# EAGLE design KK V5.5 (EAGLE 5.08)
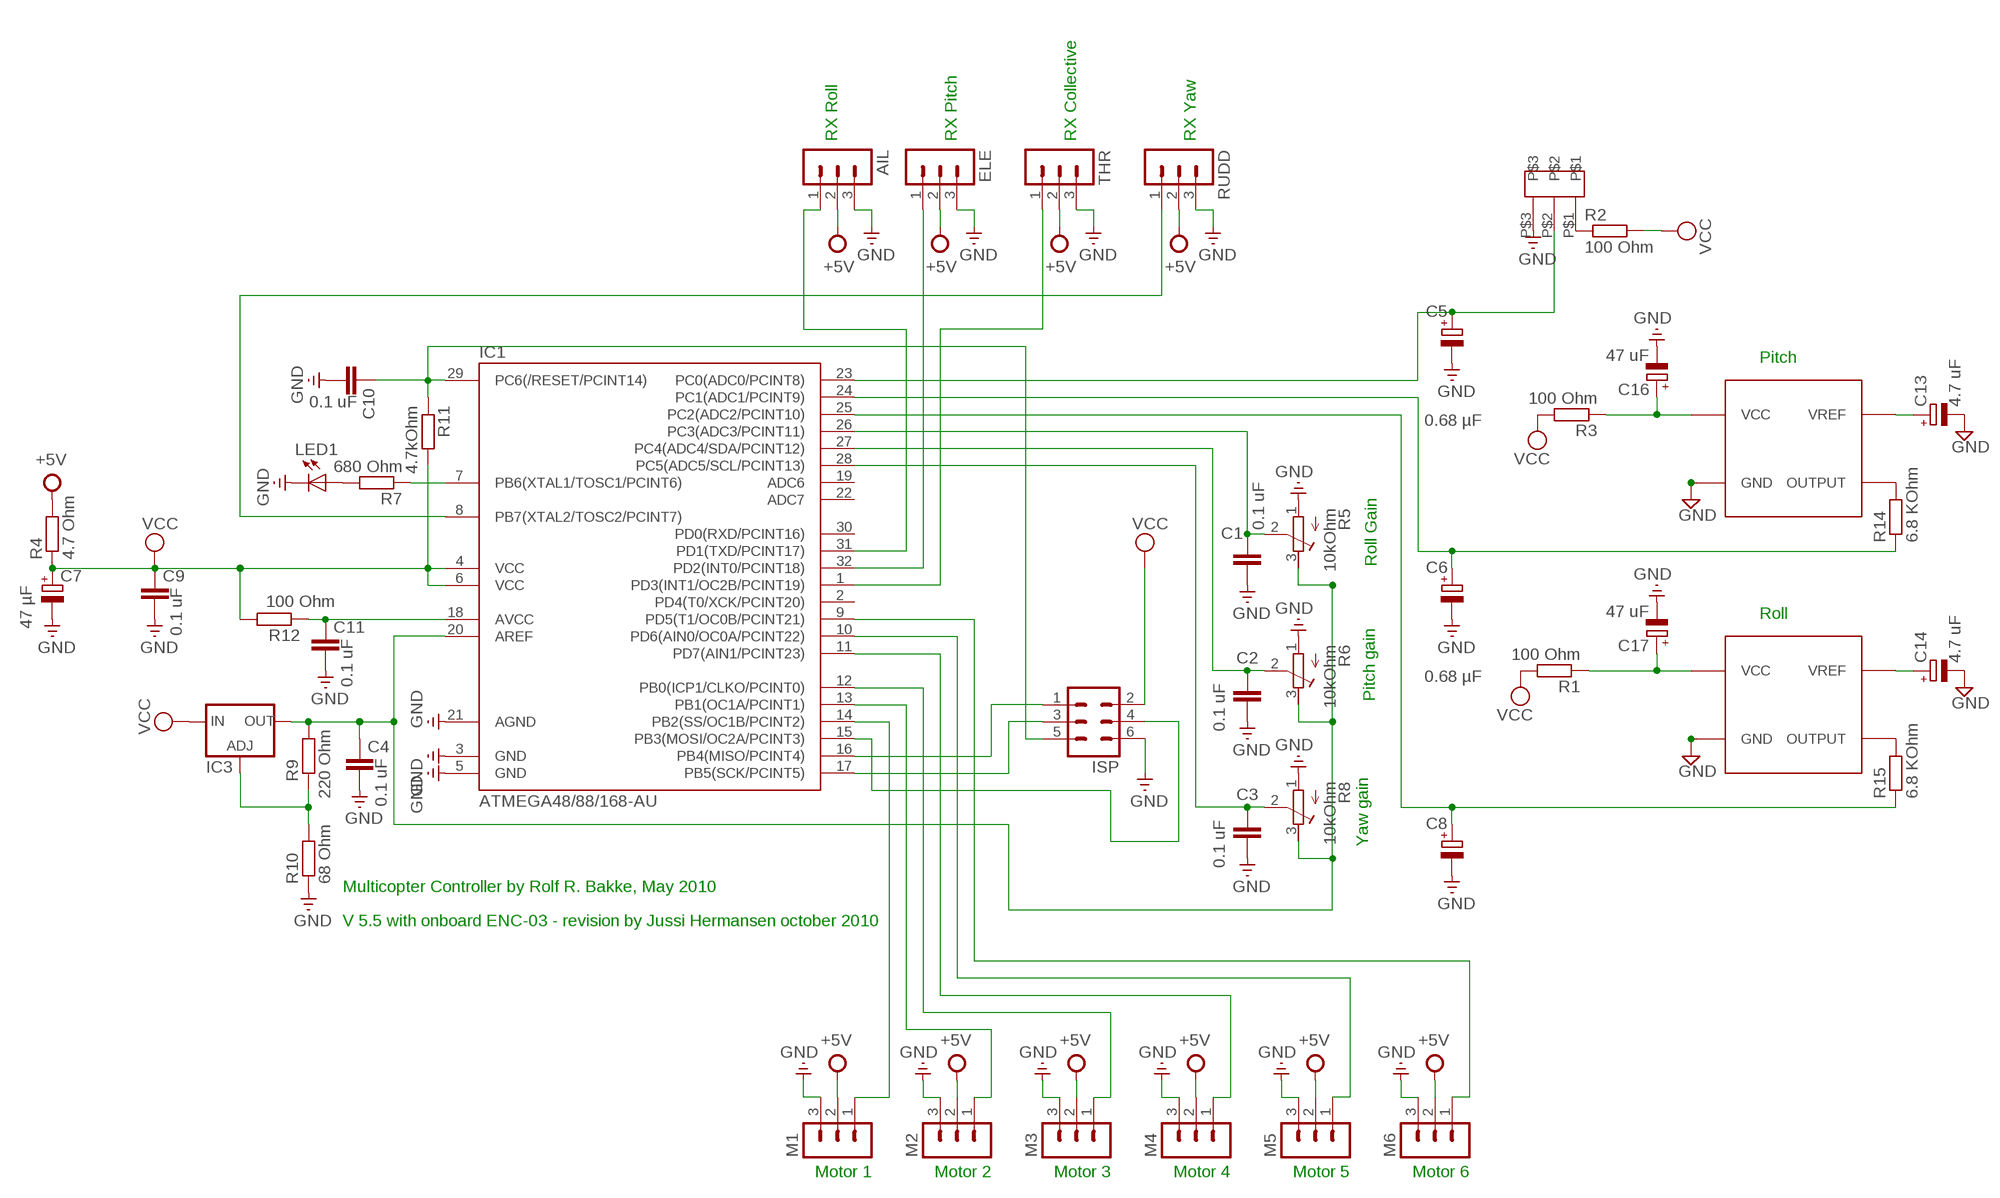
[diagram p0: schematic, sheet 1]

## Parts
AIL  MA03-1  [MA03-1]
C1  0.1 uF  C-EUC1206  [C1206]
C2  0.1 uF  C-EUC1206  [C1206]
C3  0.1 uF  C-EUC1206  [C1206]
C4  0.1 uF  C-EUC1206  [C1206]
C5  0.68 µF  CPOL-EUB/3528-21R  [B/3528-21R]
C6  0.68 µF  CPOL-EUB/3528-21R  [B/3528-21R]
C7  47 µF  CPOL-EUB/3528-21R  [B/3528-21R]
C8  0.68 µF  CPOL-EUB/3528-21R  [B/3528-21R]
C9  0.1 uF  C-EUC1206  [C1206]
C10  0.1 uF  C-EUC1206  [C1206]
C11  0.1 uF  C-EUC1206  [C1206]
C13  4.7 uF  CPOL-EUSMCB  [SMC_B]
C14  4.7 uF  CPOL-EUSMCB  [SMC_B]
C16  47 uF  CPOL-EUSMCB  [SMC_B]
C17  47 uF  CPOL-EUSMCB  [SMC_B]
ELE  MA03-1  [MA03-1]
IC1  ATMEGA48/88/168-AU  [TQFP32-08]
IC3  LM317LZ  [317L]
ISP  MA03-2  [MA03-2]
LED1  LEDCHIPLED_0805  [CHIPLED_0805]
M1  MA03-1  [MA03-1]
M2  MA03-1  [MA03-1]
M3  MA03-1  [MA03-1]
M4  MA03-1  [MA03-1]
M5  MA03-1  [MA03-1]
M6  MA03-1  [MA03-1]
PITCH  ENC-03RC  [ENC-03RC]
R1  100 Ohm  R-EU_R0805  [R0805]
R2  100 Ohm  R-EU_R0805  [R0805]
R3  100 Ohm  R-EU_R0805  [R0805]
R4  4.7 Ohm  R-EU_R0805  [R0805]
R5  10kOhm  R-TRIMM3314J  [RTRIM3314J]
R6  10kOhm  R-TRIMM3314J  [RTRIM3314J]
R7  680 Ohm  R-EU_R0805  [R0805]
R8  10kOhm  R-TRIMM3314J  [RTRIM3314J]
R9  220 Ohm  R-EU_R0805  [R0805]
R10  68 Ohm  R-EU_R0805  [R0805]
R11  4.7kOhm  R-EU_R0805  [R0805]
R12  100 Ohm  R-EU_R0805  [R0805]
R14  6.8 KOhm  R-EU_R0805W  [R0805W]
R15  6.8 KOhm  R-EU_R0805W  [R0805W]
ROLL  ENC-03RC  [ENC-03RC]
RUDD  MA03-1  [MA03-1]
THR  MA03-1  [MA03-1]
U$1  EDGE3  [EGDE3]

## Nets
+5V: AIL.2 ELE.2 M1.2 M2.2 M3.2 M4.2 M5.2 M6.2 R4.2 RUDD.2 THR.2
GND: AIL.3 C1.2 C2.2 C3.2 C4.2 C5.- C6.- C7.- C8.- C9.2 C10.2 C11.2 C13.- C14.- C16.- C17.- ELE.3 IC1.3(GND) IC1.5(GND) IC1.21(AGND) ISP.6 LED1.C M1.3 M2.3 M3.3 M4.3 M5.3 M6.3 PITCH.GND R5.1(E) R6.1(E) R8.1(E) R10.1 ROLL.GND RUDD.3 THR.3 U$1.P$3
N$1: C1.1 IC1.26(PC3(ADC3/PCINT11)) R5.2(S)
N$2: C2.1 IC1.27(PC4(ADC4/SDA/PCINT12)) R6.2(S)
N$3: C3.1 IC1.28(PC5(ADC5/SCL/PCINT13)) R8.2(S)
N$4: C4.1 IC1.20(AREF) IC3.2(OUT) R5.3(A) R6.3(A) R8.3(A) R9.2
N$5: LED1.A R7.2
N$6: IC3.1(ADJ) R9.1 R10.2
N$7: R2.1 U$1.P$1
N$8: IC1.7(PB6(XTAL1/TOSC1/PCINT6)) R7.1
N$9: C10.1 IC1.29(PC6(/RESET/PCINT14)) ISP.5 R11.1
N$10: IC1.15(PB3(MOSI/OC2A/PCINT3)) ISP.4
N$11: IC1.16(PB4(MISO/PCINT4)) ISP.1
N$12: IC1.17(PB5(SCK/PCINT5)) ISP.3
N$13: AIL.1 IC1.31(PD1(TXD/PCINT17))
N$14: ELE.1 IC1.32(PD2(INT0/PCINT18))
N$15: IC1.1(PD3(INT1/OC2B/PCINT19)) THR.1
N$16: IC1.8(PB7(XTAL2/TOSC2/PCINT7)) RUDD.1
N$17: IC1.14(PB2(SS/OC1B/PCINT2)) M1.1
N$18: IC1.13(PB1(OC1A/PCINT1)) M2.1
N$19: IC1.12(PB0(ICP1/CLKO/PCINT0)) M3.1
N$20: IC1.11(PD7(AIN1/PCINT23)) M4.1
N$21: C17.+ R1.1 ROLL.VCC
N$22: C16.+ PITCH.VCC R3.1
N$23: C13.+ PITCH.VREF
N$24: C14.+ ROLL.VREF
N$26: PITCH.OUTPUT R14.2
N$27: IC1.10(PD6(AIN0/OC0A/PCINT22)) M5.1
N$28: IC1.9(PD5(T1/OC0B/PCINT21)) M6.1
N$29: C6.+ IC1.24(PC1(ADC1/PCINT9)) R14.1
N$30: R15.2 ROLL.OUTPUT
N$31: C8.+ IC1.25(PC2(ADC2/PCINT10)) R15.1
N$33: C11.1 IC1.18(AVCC) R12.1
N$36: C5.+ IC1.23(PC0(ADC0/PCINT8)) U$1.P$2
VCC: C7.+ C9.1 IC1.4(VCC) IC1.6(VCC) IC3.3(IN) ISP.2 R1.2 R2.2 R3.2 R4.1 R11.2 R12.2
Unconnected: IC1.2(PD4(T0/XCK/PCINT20)) IC1.19(ADC6) IC1.22(ADC7) IC1.30(PD0(RXD/PCINT16))

## Notes on the sheet
- RX Roll | RX Pitch | RX Collective | RX Yaw
- Pitch
- Roll Gain
- Roll
- Pitch gain
- Yaw gain
- Multicopter Controller by Rolf R. Bakke, May 2010
- V 5.5 with onboard ENC-03 - revision by Jussi Hermansen october 2010
- Motor 1 | Motor 2 | Motor 3 | Motor 4 | Motor 5 | Motor 6

## Library data of the parts
AIL ELE M1-M6 RUDD THR = con-lstb:MA03-1: PIN HEADER
C1-C4 C9-C11 = rcl:C-EU: CAPACITOR, European symbol
C5-C8 C13 C14 C16 C17 = rcl:CPOL-EU: POLARIZED CAPACITOR, European symbol
IC1 = atmega8:ATMEGA48/88/168
IC3 = v-reg-3:LM317L: Adjustable Voltage Regulator, 1.2V to 37V, 100mA
ISP = con-lstb:MA03-2: PIN HEADER
LED1 = led:LED: LED OSRAM: - CHIPLED LG R971, LG N971, LY N971, LG Q971, LY Q971, LO R971, LY R971 LH N974, LH R974 LS Q976, LO Q976, LY Q976 LO Q996 - Hyper CHIPLED LW Q18S LB Q993, LB Q99A, LB R99A - SideLED LS A670, LO A670, LY A670, LG A670, LP A670 LB A673, LV A673, LT A673, LW A673 LH A674 LY A675 LS A676, LA A676, LO A676, LY A676, LW A676 LS A679, LY A679, LG A679 - Hyper Micro SIDELED® LS Y876, LA Y876, LO Y876, LY Y876 LT Y87S - SmartLED LW L88C, LW L88S LB L89C, LB L89S, LG L890 LS L89K, LO L89K, LY L89K LS L896, LA L896, LO L896, LY L896 - TOPLED LS T670, LO T670, LY T670, LG T670, LP T670 LSG T670, LSP T670, LSY T670, LOP T670, LYG T670 LG T671, LOG T671, LSG T671 LB T673, LV T673, LT T673, LW T673 LH T674 LS T676, LA T676, LO T676, LY T676, LB T676, LH T676, LSB T676, LW T676 LB T67C, LV T67C, LT T67C, LS T67K, LO T67K, LY T67K, LW E67C LS E67B, LA E67B, LO E67B, LY E67B, LB E67C, LV E67C, LT E67C LW T67C LS T679, LY T679, LG T679 LS T770, LO T770, LY T770, LG T770, LP T770 LB T773, LV T773, LT T773, LW T773 LH T774 LS E675, LA E675, LY E675, LS T675 LS T776, LA T776, LO T776, LY T776, LB T776 LHGB T686 LT T68C, LB T68C - Hyper Mini TOPLED® LB M676 - Mini TOPLED Santana® LG M470 LS M47K, LO M47K, LY M47K Source: http://www.osram.convergy.de LUXEON: - LUMILED® LXK2-PW12-R00, LXK2-PW12-S00, LXK2-PW14-U00, LXK2-PW14-V00 LXK2-PM12-R00, LXK2-PM12-S00, LXK2-PM14-U00 LXK2-PE12-Q00, LXK2-PE12-R00, LXK2-PE12-S00, LXK2-PE14-T00, LXK2-PE14-U00 LXK2-PB12-K00, LXK2-PB12-L00, LXK2-PB12-M00, LXK2-PB14-N00, LXK2-PB14-P00, LXK2-PB14-Q00 LXK2-PR12-L00, LXK2-PR12-M00, LXK2-PR14-Q00, LXK2-PR14-R00 LXK2-PD12-Q00, LXK2-PD12-R00, LXK2-PD12-S00 LXK2-PH12-R00, LXK2-PH12-S00 LXK2-PL12-P00, LXK2-PL12-Q00, LXK2-PL12-R00 Source: www.luxeon.com KINGBRIGHT: KA-3528ASYC Source: www.kingbright.com
PITCH ROLL = gyros:ENC-03RC
R1-R4 R7 R9-R12 = resistor:R-EU_: RESISTOR, European symbol
R5 R6 R8 = resistor:R-TRIMM: Trimm resistor
R14 R15 = rcl:R-EU_: RESISTOR, European symbol
U$1 = Egde:EDGE3

## Board
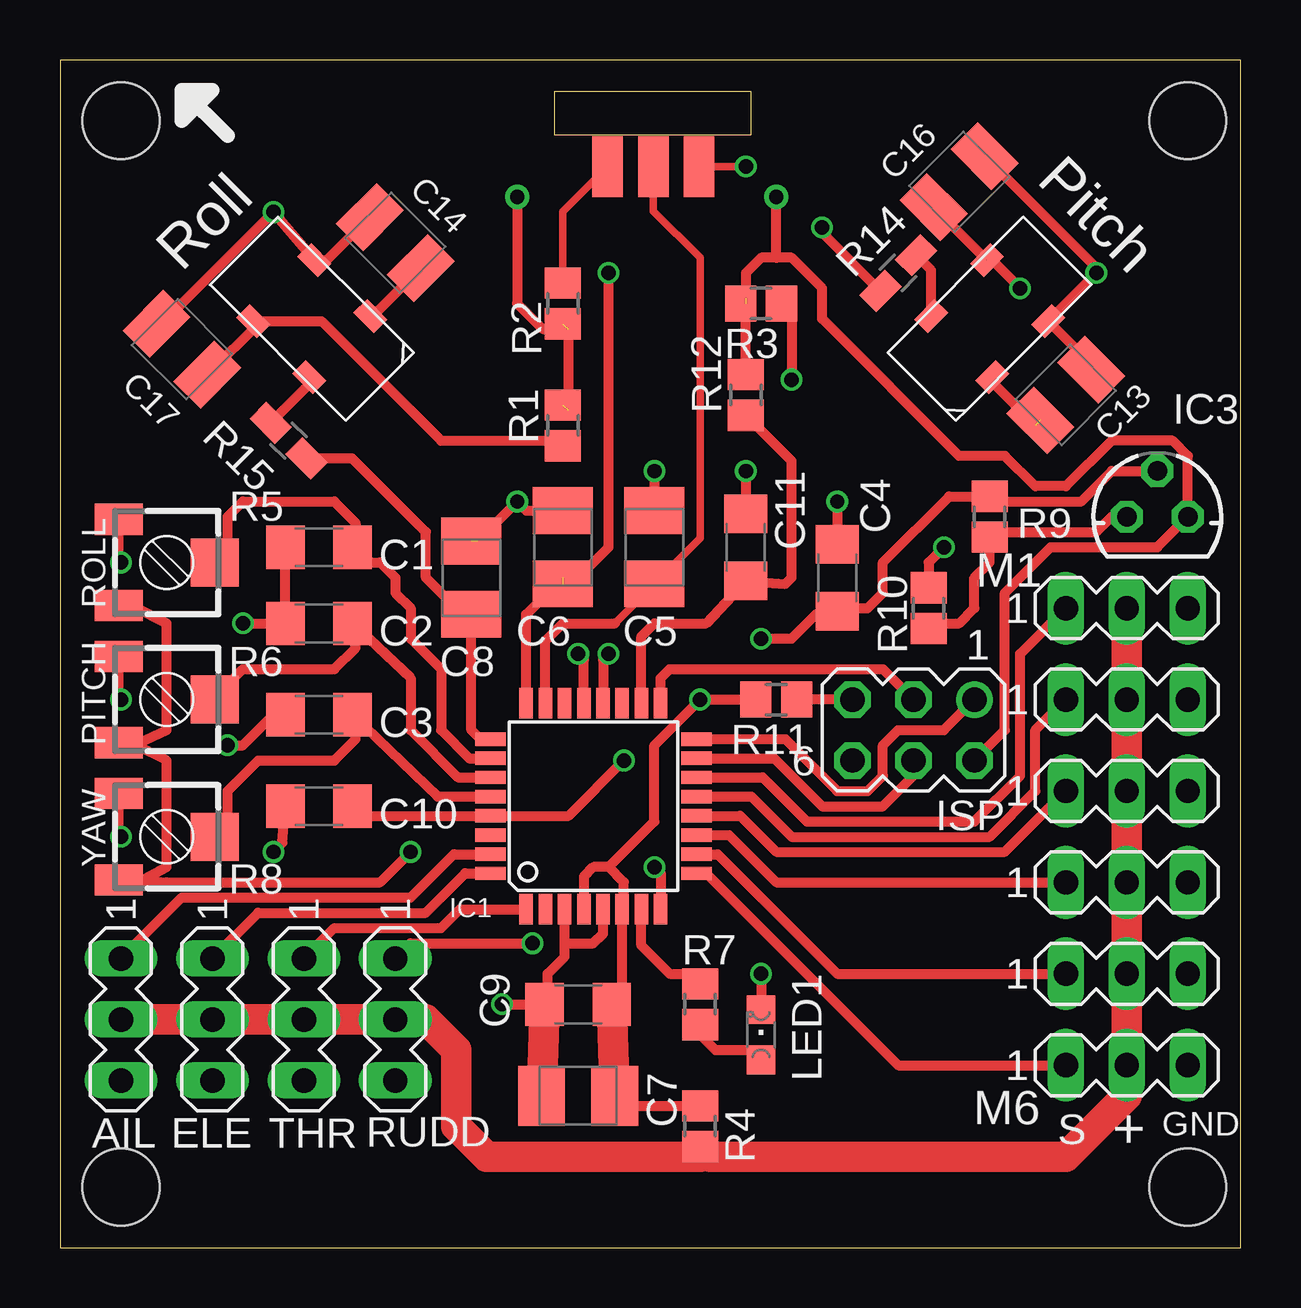
[diagram p1: board, top side]
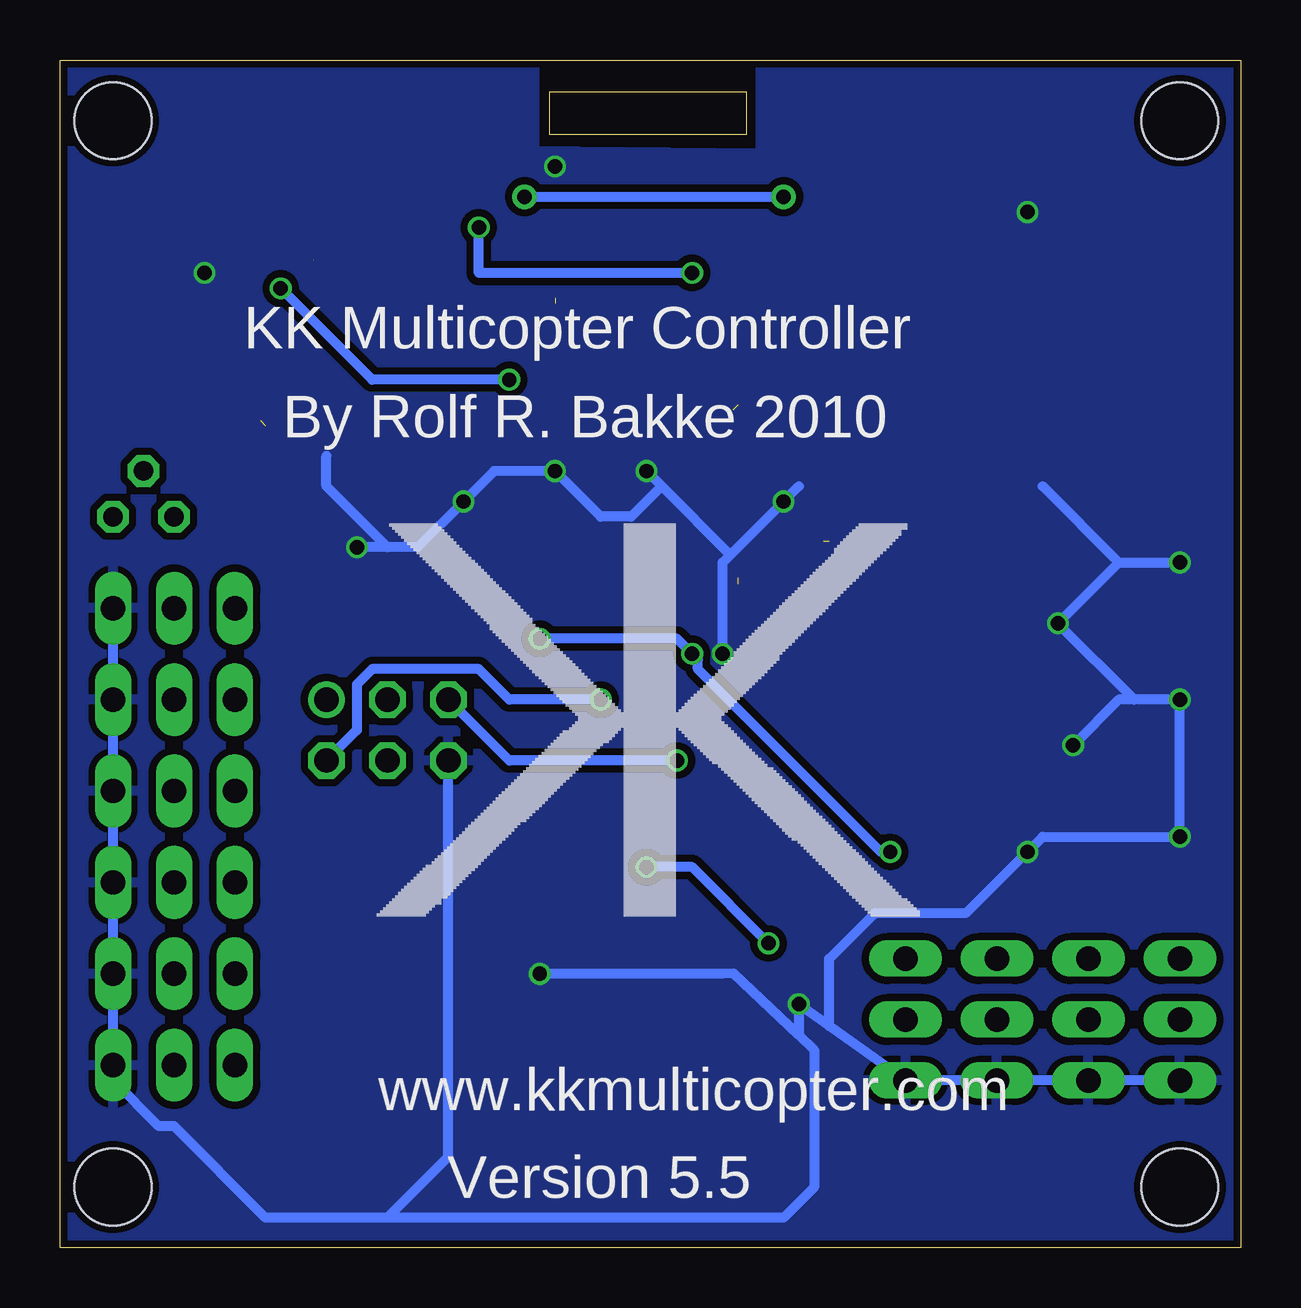
[diagram p2: board, bottom side, seen from below]

Size 49.2 x 49.52 mm. Coordinates in mm from the lower left corner, seen from the top.
Outline: 0,0 49.2,0 49.2,49.52 0,49.52 0,0
Copper layers (1*16): Top 0.035mm / dielectric 1.5mm / Bottom 0.035mm
Design rules "Fusion_eagle_rule_v1.1": minimum track width 6mil, minimum drill 12mil, track to track 6mil, track to pad 6mil, pad to pad 6mil, via to via 6mil, smd to smd 0mil, copper to edge 10mil, drill to drill 10mil, minimum pad ring 10mil, minimum via ring 6mil, stop-mask expansion 2mil, vias tented up to drill 100mil, thermal gap 10mil
Holes 3.2 mm at 2.54,46.99 46.99,46.99 46.99,2.54 2.54,2.54
Milling: area 20.6,46.4 to 28.8,48.2

### Footprints (pad centres in the part's own frame; a part is rotated, then mirrored left to right if it is on the bottom)
MA03-1 = drill 1.016 long: 1 -2.54,0; 2 0,0; 3 2.54,0
C1206 = smd 1.6 x 1.8: 1 -1.4,0; 2 1.4,0
B/3528-21R = smd 1.95 x 2.5: + 1.525,0; - -1.525,0
SMC_B = smd 1.6 x 2.4: + -1.5,0; - 1.5,0
TQFP32-08 = smd 1.27 x 0.559: 1 -4.293,2.8; 2 -4.293,2; 3 -4.293,1.2; 4 -4.293,0.4; 5 -4.293,-0.4; 6 -4.293,-1.2; 7 -4.293,-2; 8 -4.293,-2.8; 17 4.293,-2.8; 18 4.293,-2; 19 4.293,-1.2; 20 4.293,-0.4; 21 4.293,0.4; 22 4.293,1.2; 23 4.293,2; 24 4.293,2.8 | smd 0.559 x 1.27: 9 -2.8,-4.293; 10 -2,-4.293; 11 -1.2,-4.293; 12 -0.4,-4.293; 13 0.4,-4.293; 14 1.2,-4.293; 15 2,-4.293; 16 2.8,-4.293; 25 2.8,4.293; 26 2,4.293; 27 1.2,4.293; 28 0.4,4.293; 29 -0.4,4.293; 30 -1.2,4.293; 31 -2,4.293; 32 -2.8,4.293
317L = drill 0.813 octagon: 1 -1.27,0; 2 0,1.905; 3 1.27,0
MA03-2 = drill 1.016 round: 1 -2.54,-1.27 | drill 1.016 octagon: 2 -2.54,1.27; 3 0,-1.27; 4 0,1.27; 5 2.54,-1.27; 6 2.54,1.27
CHIPLED_0805 = smd 1.2 x 1.2: A 0,-1.05; C 0,1.05
ENC-03RC = smd 1.2 x 0.8: GND 1.65,-1.8; OUTPUT -1.65,1.8; VCC 1.65,1.8; VREF -1.65,-1.8
R0805 = smd 1.3 x 1.5: 1 -0.85,0; 2 0.85,0
RTRIM3314J = smd 1.3 x 2: 1 -1.8,-2; 3 1.8,-2 | smd 2 x 2: 2 0,2
R0805W = smd 1.5 x 1: 1 -1.052,0; 2 1.052,0
EGDE3 = smd 1.27 x 2.54: P$1 -5.08,1.27; P$2 -3.175,1.27; P$3 -1.27,1.27

### Placement (x,y rotation side)
AIL  2.54,9.53 270 top
C1  10.79,29.21 180 top
C2  10.79,26.04 180 top
C3  10.79,22.23 180 top
C4  32.38,27.94 90 top
C5  24.77,29.21 270 top
C6  20.95,29.21 270 top
C7  21.59,6.35 0 top
C8  17.14,27.94 270 top
C9  21.59,10.16 180 top
C10  10.79,18.41 180 top
C11  28.57,29.21 90 top
C13  41.91,35.56 45 top
C14  13.97,41.91 135 top
C16  37.47,44.45 45 top
C17  5.08,37.47 135 top
ELE  6.35,9.53 270 top
IC1  22.23,18.41 90 top
IC3  45.72,30.48 0 top
ISP  35.56,21.59 180 top
LED1  29.21,8.89 0 top
M1  44.45,26.67 0 top
M2  44.45,22.86 0 top
M3  44.45,19.05 0 top
M4  44.45,15.24 0 top
M5  44.45,11.43 0 top
M6  44.45,7.62 0 top
PITCH  38.73,38.73 45.1 top
R1  20.95,34.29 90 top
R2  20.95,39.37 270 top
R3  29.21,39.37 180 top
R4  26.67,5.08 270 top
R5  4.45,28.57 270 top
R6  4.45,22.86 270 top
R7  26.67,10.16 270 top
R8  4.45,17.14 270 top
R9  38.73,30.48 90 top
R10  36.2,26.67 270 top
R11  29.84,22.86 180 top
R12  28.57,35.56 90 top
R14  34.92,40.64 45.1 top
R15  9.53,33.66 135 top
ROLL  10.49,38.73 135 top
RUDD  13.97,9.53 270 top
THR  10.16,9.53 270 top
U$1  27.9,43.8 0 top
U$2  [KKLOGO2]  10.21,5.18 0 top

### Tracks (layer width: path | path; a pad name or v marks a point on that pad's centre or on a via)
+5V
  Top 1.27: M1.2 M2.2 M3.2 M4.2 M5.2 M6.2 44.45,6.35 41.91,3.81 27.09,3.81 R4.2 26.67,3.81 17.78,3.81 16.51,5.08 16.51,8.26 15.24,9.53 RUDD.2 THR.2 ELE.2 AIL.2
GND  (via drill 0.6)  (1 unrouted)
  Top 0.305: U$1.P$3 28.56,45.07 v28.57,45.09
  Top 0.406: v18.41,10.16 C9.2 20.32,10.41 20.32,11.43 21.02,12.13 21.02,12.7 | v29.21,11.43 LED1.C | IC1.21 21.82,24.53 v21.59,24.77 | v24.77,32.38 C5.- | R10.1 36.2,28.57 v36.83,29.21 | C6.- 19.43,30.73 v19.05,31.11 17.4,29.46 | v7.62,26.04 C2.2 C1.2 | C3.2 8.89,22.23 7.62,20.95 v6.99,20.95 | C10.2 9.27,16.89 v8.89,16.51 | R5.1 2.44,28.67 v2.54,28.57 | R6.1 2.44,22.95 v2.54,22.86 | R8.1 2.44,17.24 v2.54,17.14 | v32.38,31.11 C4.2 | v28.57,32.38 C11.2 | 21.02,12.7 IC1.3 | IC1.5 22.62,13.1 22.23,12.7 21.02,12.7 | C17.- 4.24,38.53 v8.89,43.18 v8.9,43.18 ROLL.GND 11.11,41.17 C14.- | C13.- 42.97,36.84 PITCH.GND v43.18,40.64 43.18,40.86 C16.-
  Top 1.27: C9.2 C7.-
  Bottom 0.406: AIL.3 ELE.3 THR.3 RUDD.3 17.15,9.26 | 17.15,9.26 v18.41,10.16 18.41,8.89 | 35.56,1.27 19.05,1.27 17.78,2.54 17.78,8.26 18.41,8.89 | 35.56,1.27 40.64,1.27 44.45,5.08 45.09,5.08 46.99,6.99 M6.3 M5.3 M4.3 M3.3 M2.3 M1.3 | 18.41,8.89 21.12,11.44 21.59,11.43 v29.21,11.43 | 17.15,9.26 17.15,12.06 15.24,13.97 11.43,13.97 v8.89,16.51 8.26,17.14 v2.54,17.14 v2.54,22.86 | v2.54,22.86 5.08,22.86 v6.99,20.95 | v2.54,22.86 4.45,22.86 v7.62,26.04 5.08,28.57 | 5.08,28.57 v2.54,28.57 | 5.08,28.57 8.26,31.75 | 18.41,31.75 v19.05,31.11 21.27,28.89 | v21.59,24.77 21.59,28.57 21.27,28.89 | 21.27,28.89 24.13,31.75 | 24.13,31.75 v24.77,32.38 | 24.13,31.75 25.4,30.48 26.67,30.48 v28.57,32.38 31.11,32.38 v32.38,31.11 34.29,29.21 35.56,29.21 | 35.56,29.21 v36.83,29.21 | 35.56,29.21 38.1,31.75 38.1,33.02 | ISP.6 33.02,3.81 35.56,1.27
  pour Bottom (isolate 0.305): 0,49.53 20.02,49.43 20.02,45.62 29.41,45.72 29.41,49.53 49.53,49.53 49.53,0 0,0
N$1
  Top 0.406: IC1.26 17.05,20.41 15.88,21.59 15.88,24.13 14.61,25.4 14.61,26.67 13.97,27.3 13.97,27.94 13.34,28.57 12.96,28.57 C1.1 12.32,30.23 11.43,31.11 7.62,31.11 6.99,30.48 6.99,29.11 R5.2
N$2
  Top 0.406: 7.08,22.23 R6.2 6.99,23.4 6.99,23.5 7.62,24.13 11.43,24.13 12.32,25.02 C2.1 14.61,23.75 14.61,21.59 16.58,19.61 IC1.27
N$3
  Top 0.406: IC1.28 15.73,18.82 C3.1 12.32,21.21 11.43,20.32 8.26,20.32 6.99,19.05 6.99,17.68 R8.2
N$4  (via drill 0.6)
  Top 0.406: IC1.20 22.62,24.53 v22.86,24.77 | v14.61,16.51 13.34,15.24 4.45,15.24 3.28,15.35 R8.3 3.08,15.14 4.45,15.88 4.45,20.32 3.17,20.95 2.55,20.95 R6.3 3.28,21.06 4.45,21.59 4.45,26.04 3.17,26.67 2.55,26.67 R5.3 | v29.21,25.4 30.48,25.4 31.5,26.41 C4.1 32.64,26.67 33.66,26.67 34.29,27.3 34.29,28.57 37.05,31.33 R9.2 38.95,31.11 42.55,31.11 43.81,32.38 IC3.2
  Bottom 0.406: v14.61,16.51 15.01,16.51 22.62,24.13 22.62,24.53 v22.86,24.77 23.5,25.4 v29.21,25.4
N$5
  Top 0.406: R7.2 26.67,8.89 27.3,8.26 28.8,8.26 LED1.A
N$6
  Top 0.406: IC3.1 43.81,30.48 43.18,29.84 38.95,29.84 R9.1 38.73,28.57 38.1,27.94 38.1,26.67 37.47,26.04 36.41,26.04 R10.2
N$7
  Top 0.305: R2.1 20.95,43.2 U$1.P$1
N$8
  Top 0.406: IC1.7 24.23,12.61 25.4,11.43 26.25,11.43 R7.1
N$9  (via drill 0.6)
  Top 0.406: v23.5,20.32 21.19,18.02 IC1.29 12.72,18.02 C10.1 | ISP.5 R11.1
  Bottom 0.406: v23.5,20.32 30.48,20.32 ISP.5
N$10
  Top 0.406: IC1.15 29.75,20.41 31.75,18.41 34.29,18.41 35.56,19.68 ISP.4
N$11
  Top 0.406: IC1.16 30.22,21.21 32.38,19.05 33.66,19.05 34.29,19.68 34.29,20.95 34.92,21.59 36.83,21.59 ISP.1
N$12
  Top 0.406: IC1.17 25.02,23.75 25.4,24.13 34.29,24.13 ISP.3
N$13
  Top 0.406: IC1.31 16.41,16.41 14.61,14.61 5.08,14.61 AIL.1
N$14
  Top 0.406: IC1.32 16.89,15.62 15.24,13.97 8.26,13.97 ELE.1
N$15
  Top 0.406: IC1.1 16.66,14.12 15.88,13.34 11.43,13.34 THR.1
N$16  (via drill 0.6)
  Top 0.406: IC1.8 25.02,15.62 v24.77,15.88 | v19.68,12.7 14.61,12.7 RUDD.1
  Bottom 0.406: v19.68,12.7 22.86,15.88 v24.77,15.88
N$17
  Top 0.406: IC1.14 29.28,19.61 31.11,17.78 38.1,17.78 40.01,19.68 40.01,24.77 M1.1
N$18
  Top 0.406: IC1.13 28.81,18.82 30.48,17.14 38.73,17.14 40.64,19.05 40.64,21.59 M2.1
N$19
  Top 0.406: IC1.12 28.34,18.02 29.84,16.51 39.37,16.51 M3.1
N$20
  Top 0.406: IC1.11 27.87,17.21 29.84,15.24 M4.1
N$21
  Top 0.406: C17.+ 8.36,38.62 ROLL.VCC 10.9,38.63 15.88,33.66 20.74,33.66 R1.1
N$22  (via drill 0.6)  (1 unrouted)
  Top 0.406: v30.48,36.2 30.48,38.95 R3.1 | 36.2,43.81 36.2,43.6 C16.+ PITCH.VCC 38.84,41.17 v40.01,40.01
  Bottom 0.406: v30.48,36.2 36.2,36.2 v40.01,40.01
N$23  (1 unrouted)
  Top 0.406: PITCH.VREF 38.84,36.09 40.64,34.29
N$24
  Top 0.406: ROLL.VREF 13.23,39.05 C14.+
N$26
  Top 0.406: PITCH.OUTPUT 36.3,40.76 R14.2
N$27
  Top 0.406: IC1.10 27.4,16.41 32.38,11.43 M5.1
N$28
  Top 0.406: IC1.9 26.93,15.62 34.92,7.62 M6.1
N$29  (via drill 0.6)  (1 unrouted)
  Top 0.406: IC1.24 19.43,26.41 20.95,27.94 21.59,27.94 22.86,29.21 v22.86,40.64 | 33.77,39.89 R14.1 31.75,42.33 v31.75,42.55
  Bottom 0.406: v22.86,40.64 31.75,40.64 v31.75,42.55
N$30
  Top 0.406: ROLL.OUTPUT 10.68,36.3 R15.2
N$31
  Top 0.406: IC1.25 17.52,21.21 17.14,21.59 C8.+ 16.89,26.67 16.51,26.67 15.24,27.94 15.24,29.84 12.17,32.91 R15.1
N$33
  Top 0.406: IC1.18 24.23,25.5 24.77,26.04 26.93,26.04 C11.1 30.23,27.68 30.48,27.94 30.48,32.8 R12.1
N$36
  Top 0.305: 23.11,26.04 C5.+ 26.67,29.59 26.67,41.27 24.73,43.22 U$1.P$2
  Top 0.406: IC1.23 20.23,25.3 20.95,26.04 23.11,26.04
VCC  (via drill 0.6, 0.6 pad 1.02)  (3 unrouted)
  Top 0.406: IC1.4 21.82,15.47 22.23,15.88 22.86,15.88 | 22.86,15.88 23.5,15.24 23.5,14.12 IC1.6 23.43,10.16 C9.1 | R4.1 23.54,5.93 C7.+ | ISP.2 39.37,21.59 39.37,27.3 41.27,29.21 45.72,29.21 IC3.3 46.99,33.02 46.35,33.66 43.81,33.66 41.91,31.75 40.64,31.75 39.37,33.02 37.47,33.02 31.75,38.73 31.75,40.01 30.48,41.27 29.84,41.27 | 22.86,15.88 24.77,17.78 24.77,20.95 v26.67,22.86 R11.2 | 21.17,34.92 21.17,38.3 20.11,38.3 19.05,39.37 v19.05,43.81 | 28.57,39.59 28.57,40.64 29.21,41.27 29.84,41.27 | 28.36,36.62 R12.2 28.57,39.37 R3.2 | 29.84,41.27 v29.84,43.81
  Top 1.27: C7.+ C9.1
  Bottom 0.406: v26.67,22.86 30.48,22.86 31.75,24.13 36.2,24.13 36.83,23.5 36.83,21.59 ISP.2 | v29.84,43.81 v19.05,43.81

### Text on the board
tNames: Pitch | Roll | ROLL | PITCH | YAW | GND | THR | S | +
bNames: KK Multicopter Controller | By Rolf R. Bakke 2010 | www.kkmulticopter.com | Version 5.5